# Altium schematic sheet MotorDriver2.SchDoc
size A4; SheetNumber: 10; SheetTotal: 11
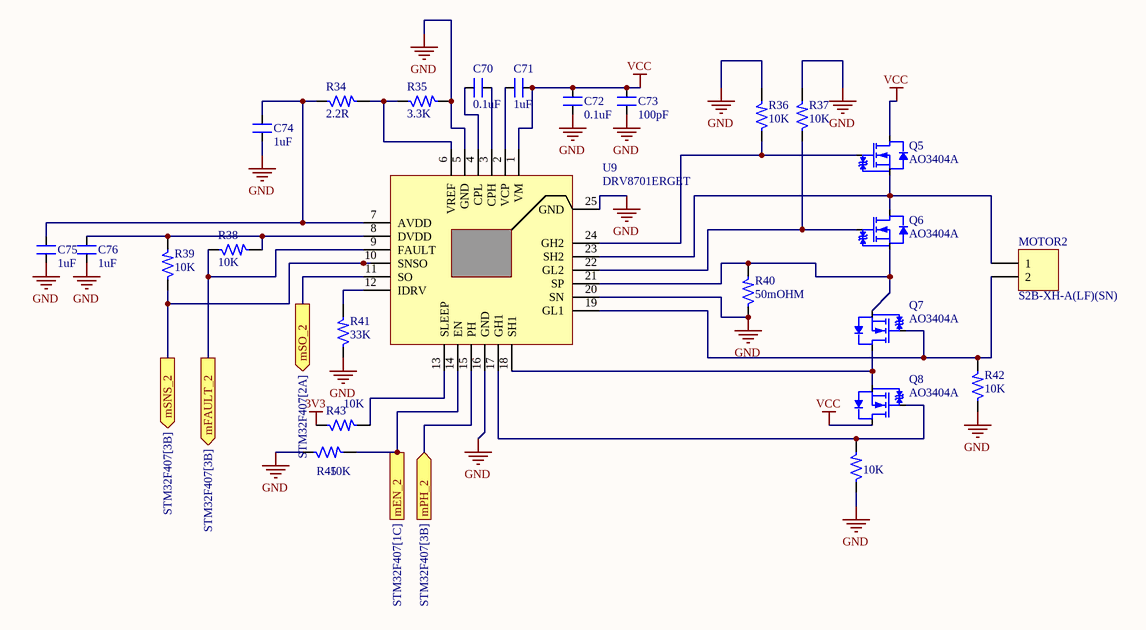
[diagram p0: MotorDriver2.SchDoc]

## Parts
C70  0.1uF  [CAP_0805]
C71  1uF  [CAP_0805]
C72  0.1uF  [CAP_0805]
C73  100pF  [CAP_0805]
C74  1uF  [CAP_0805]
C75  1uF  [CAP_0805]
C76  1uF  [CAP_0805]
MOTOR2  S2B-XH-A(LF)(SN)  [CON2_100_S2B-XH-A_TH_RA]
Q5  AO3404A  [SOT 23-3]
Q6  AO3404A  [SOT 23-3]
Q7  AO3404A  [SOT 23-3]
Q8  AO3404A  [SOT 23-3]
R34  2.2R  [RES_0603]
R35  3.3K  [RES_0805]
R36  10K  [RES_0805]
R37  10K  [RES_0805]
R38  10K  [RES_0805]
R39  10K  [RES_0805]
R40  50mOHM  [RES_2512]
R41  33K  [RES_0805]
R42  10K  [RES_0805]
R43  10K  [RES_0805]
R44  10K  [RES_0805]
R45  10K  [RES_0805]
U9  DRV8701ERGET  [VFQFN24_19.6_196_12X32_SMD_1]

## Ports
mEN_2 (in, see STM32F407[1C]), mFAULT_2 (out, see STM32F407[3B]), mPH_2 (in, see STM32F407[3B]), mSNS_2 (out, see STM32F407[3B]), mSO_2 (out, see STM32F407[2A])

## Nets
3V3: R43.1
GND: C72.1 C73.1 C74.1 C75.1 C76.1 R35.2 R36.2 R37.2 R40.1 R41.1 R42.1 R44.1 R45.1 U9.5(GND) U9.16(GND) U9.20(SN) U9.25(GND)
VCC: C71.1 C72.2 C73.2 Q5.3(D) Q8.3(D) U9.1(VM)
mEN_2: R45.2 U9.14(EN) ; port mEN_2
mFAULT_2: R38.1 U9.9(FAULT) ; port mFAULT_2
mPH_2: U9.15(PH) ; port mPH_2
mSNS_2: R39.1 U9.10(SNSO) ; port mSNS_2
mSO_2: U9.11(SO) ; port mSO_2
NetC70_1: C70.1 U9.3(CPH)
NetC70_2: C70.2 U9.4(CPL)
NetC71_2: C71.2 U9.2(VCP)
NetC74_2: C74.2 C75.2 R34.1 U9.7(AVDD)
NetC76_2: C76.2 R38.2 R39.2 U9.8(DVDD)
NetMOTOR2_1: MOTOR2.1 Q5.2(S) Q6.3(D) U9.23(SH2)
NetMOTOR2_2: MOTOR2.2 Q7.1(G) R42.2 U9.19(GL1)
NetQ5_1: Q5.1(G) R36.1 U9.24(GH2)
NetQ6_1: Q6.1(G) R37.1 U9.22(GL2)
NetQ6_2: Q6.2(S) Q7.2(S) R40.2 U9.21(SP)
NetQ7_3: Q7.3(D) Q8.2(S) U9.18(SH1)
NetQ8_1: Q8.1(G) R44.2 U9.17(GH1)
NetR34_2: R34.2 R35.1 U9.6(VREF)
NetR41_2: R41.2 U9.12(IDRV)
NetR43_2: R43.2 U9.13(SLEEP)

## Library data of the parts
C70 C72 = CAP_0.1uF-50V-20%-0805: 0.1µF ±20% 50V Ceramic Capacitor X7R 0805 (2012 Metric); Manufacturer: Samsung Electro-Mechanics; Manufacturer Part Number: CL21B104MBCNNNC; Alternate Part Number-1: NA; Case/Package: 0805; Supplier-1: SIRICOM; Supplier Part Number-1: 0805B104K500CT
C71 C74-C76 = CAP_1uF-50V-5%-0805: 1µF ±5% 50V Ceramic Capacitor X7R 0805 (2012 Metric); Manufacturer: Samsung; Manufacturer Part Number: CC0805JKX7R9BB105; Alternate Part Number-1: 0805F105M500NT; Case/Package: 0805; Supplier-1: SIRICOM; Supplier Part Number-1: CL21B105KBFNNNE
C73 = CAP_100pF-100V-5%-0805: 100pF ±5% 100V Ceramic Capacitor C0G, NP0 0805 (2012 Metric); Manufacturer: Murata; Manufacturer Part Number: CL21C101JC61PNC; Alternate Part Number-1: NA; Case/Package: 0805; Supplier-1: SIRICOM; Supplier Part Number-1: 0805N101J101CT
MOTOR2 = CON-PLG_2X1-100-RA-TH: 2 Pins, 1 Row 2.54mm Pitch, right angle Connector, male; Manufacturer: JST; Mating Part Number: XHP-2; Crimp Part Number: ASXHSXH22K51; Alternate Part Number-1: NA; Manufacturer Part Number: S2B-XH-A(LF)(SN); Case/Package: TH-CON; Supplier-1: ARROW; Supplier Part Number-1: S2B-XH-A(LF)(SN)
Q5-Q8 = MOSFET-N_30V-5.8A-SOT23: N-Channel 30V 5.8A (Ta) 1.4W (Ta) Surface Mount SOT-23-3L; Manufacturer: International Rectifier; Alternate Part Number-1: PMV50ENEAR; Manufacturer Part Number: AO3404A; Case/Package: SOT23; Supplier-1: ARROW; Supplier Part Number-1: AO3404A
R34 = RES_2.2R-0.1W-1%-0603: 2.2 Ohms ±1% 0.1W, 1/10W Chip Resistor 0603 (1608 Metric) Automotive AEC-Q200, Current Sense Thick Film; Manufacturer: Panasonic Electronic Components; Manufacturer Part Number: ERJ-3RQF2R2V; Alternate Part Number-1: NA; Case/Package: 0603; Supplier-1: SIRICOM; Supplier Part Number-1: NA
R35 = RES_3.3K-0.125W-1%-0805: 3.3 kOhms ±1% 0.125W, 1/8W Chip Resistor 0805 (2012 Metric) Thick Film; Manufacturer: Panasonic; Manufacturer Part Number: 1623214-1; Alternate Part Number-1: 0805W8F3301T5E; Case/Package: 0805; Supplier-1: SIRICOM; Supplier Part Number-1: WR08X3301FTL
R36-R39 R42-R45 = RES_10K-0.125W-1%-0805: 10 kOhms ±1% 0.125W, 1/8W Chip Resistor 0805 (2012 Metric) Automotive AEC-Q200 Thick Film; Manufacturer: CTS; Manufacturer Part Number: WR08X1002FTL; Case/Package: 0805; Supplier-1: SIRICOM; Supplier Part Number-1: WR08X1002FTL; Alternate Part Number-1: WR08X1002FTL
R40 = RES_50mOhm-2W-1%-2512: 50 mOhms ±1% 2W Chip Resistor 2512 (6432 Metric) Automotive AEC-Q200, Current Sense, Moisture Resistant Metal Element; Manufacturer: Yageo; Manufacturer Part Number: PA2512FKF7W0R05E; Alternate Part Number-1: PMR100HZPFU5L00; Case/Package: 2512; Supplier-1: SIRICOM; Supplier Part Number-1: LR2512-22R060F1
R41 = RES_33K-0.125W-1%-0805: Thick Film Resistors - SMD 33KOhms 1/8W 150V33 kOhms ±1% 0.125W, 1/8W Chip Resistor 0805 (2012 Metric) Thick Film; Manufacturer: Vishay BCcomponents; Manufacturer Part Number: CRG0805F33K; Alternate Part Number-1: NA; Case/Package: 0805; Supplier-1: SIRICOM; Supplier Part Number-1: WR08X3302FTL
U9 = IC_DRV8701ERGET: Motor Driver Power MOSFET Parallel 24-VQFN (4x4); Manufacturer: Texas Instruments; Alternate Part Number-1: NA; Manufacturer Part Number: DRV8701ERGET; Case/Package: VFQFN24; Supplier-1: ARROW; Supplier Part Number-1: DRV8701ERGET